# EAGLE design signal (EAGLE 4.16)
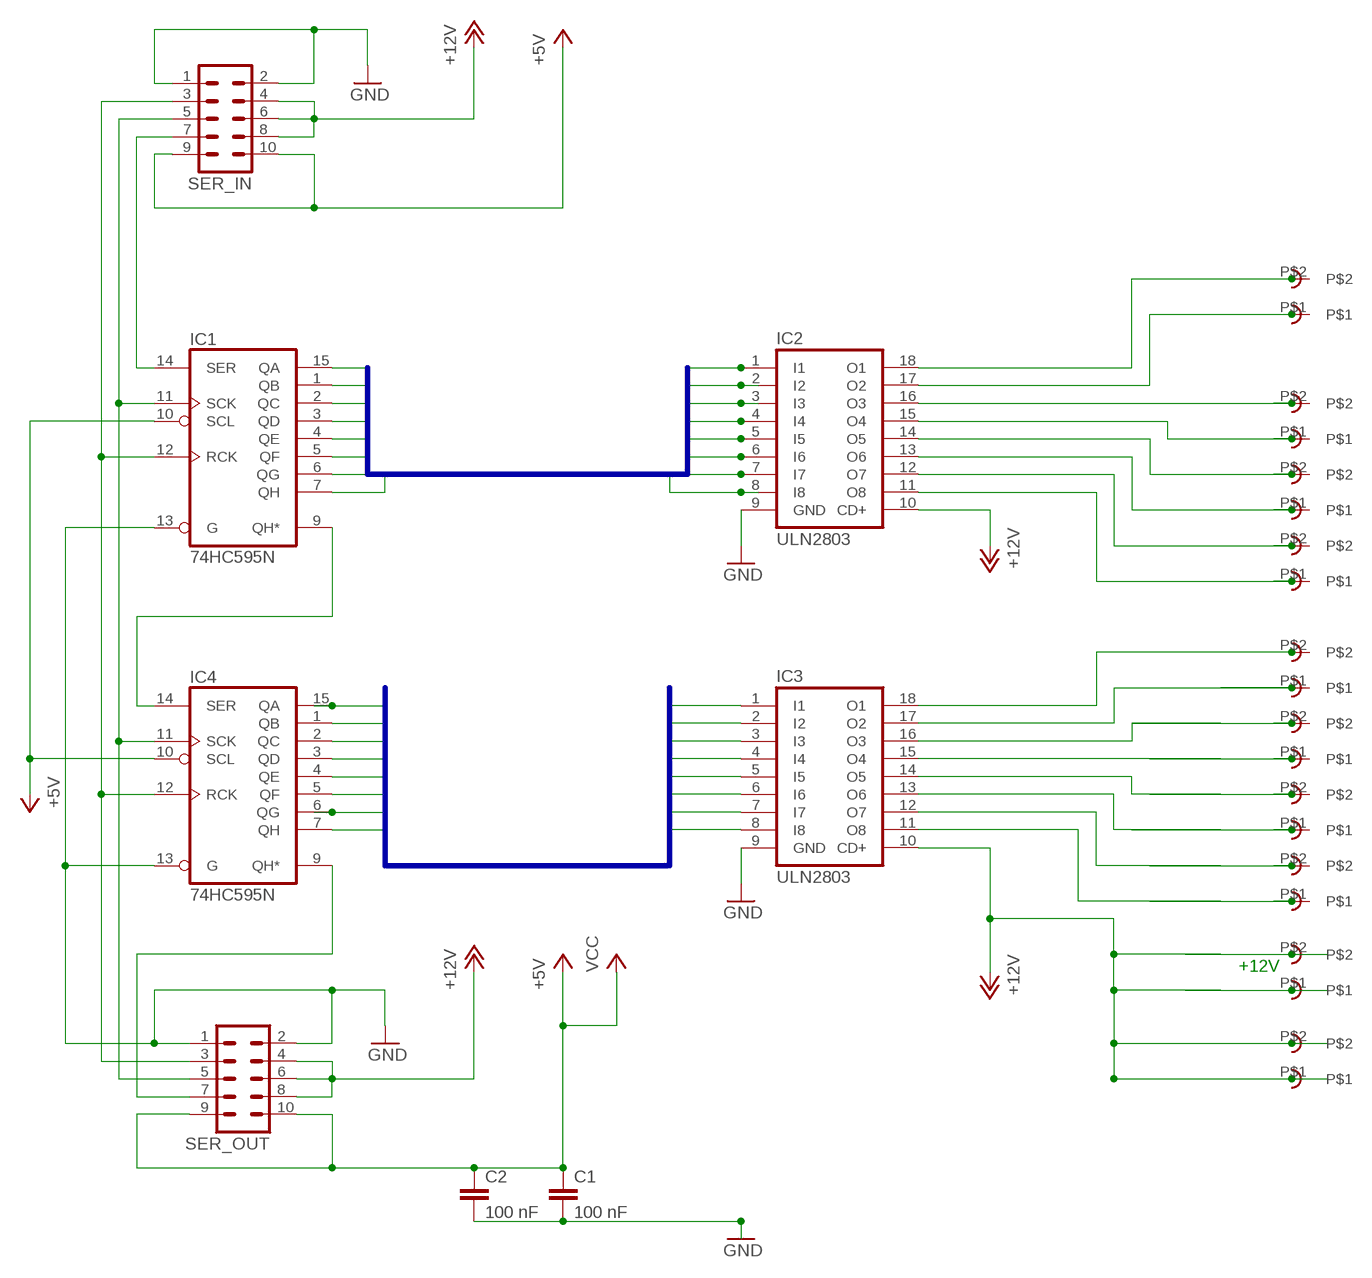
[diagram p0: schematic, sheet 1]

## Parts
C1  100 nF  C-EU025-030X050  [C025-030X050]
C2  100 nF  C-EU025-030X050  [C025-030X050]
IC1  74HC595N  [DIL16]
IC2  ULN2803  ULN2804A  [DIL18]
IC3  ULN2803  ULN2804A  [DIL18]
IC4  74HC595N  [DIL16]
SER_IN  ML10  [ML10]
SER_OUT  ML10  [ML10]
U$11  RIACON101-2  [RIACON101-2]
U$13  RIACON101-2  [RIACON101-2]
U$14  RIACON101-2  [RIACON101-2]
U$15  RIACON101-2  [RIACON101-2]
U$16  RIACON101-2  [RIACON101-2]
U$17  RIACON101-2  [RIACON101-2]
U$18  RIACON101-2  [RIACON101-2]
U$19  RIACON101-2  [RIACON101-2]
U$20  RIACON101-2  [RIACON101-2]
U$21  RIACON101-2  [RIACON101-2]

## Nets
+12V: IC2.10(CD+) IC3.10(CD+) SER_IN.4 SER_IN.6 SER_IN.8 SER_OUT.4 SER_OUT.6 SER_OUT.8 U$20.P$1 U$20.P$2 U$21.P$1 U$21.P$2
BUSA0: IC1.15(QA) IC2.8(I8)
BUSA1: IC1.1(QB) IC2.7(I7)
BUSA2: IC1.2(QC) IC2.6(I6)
BUSA3: IC1.3(QD) IC2.5(I5)
BUSA4: IC1.4(QE) IC2.4(I4)
BUSA5: IC1.5(QF) IC2.3(I3)
BUSA6: IC1.6(QG) IC2.2(I2)
BUSA7: IC1.7(QH) IC2.1(I1)
BUSB0: IC3.8(I8) IC4.15(QA)
BUSB1: IC3.7(I7) IC4.1(QB)
BUSB2: IC3.6(I6) IC4.2(QC)
BUSB3: IC3.5(I5) IC4.3(QD)
BUSB4: IC3.4(I4) IC4.4(QE)
BUSB5: IC3.3(I3) IC4.5(QF)
BUSB6: IC3.2(I2) IC4.6(QG)
BUSB7: IC3.1(I1) IC4.7(QH)
CLOCK: IC1.11(SCK) IC4.11(SCK) SER_IN.5 SER_OUT.5
GND: C1.2 C2.2 IC1.13(G) IC2.9(GND) IC3.9(GND) IC4.13(G) SER_IN.1 SER_IN.2 SER_OUT.1 SER_OUT.2
N$21: IC2.11(O8) U$15.P$1
N$22: IC2.16(O3) U$13.P$2
N$23: IC2.15(O4) U$13.P$1
N$24: IC2.14(O5) U$14.P$2
N$25: IC2.13(O6) U$14.P$1
N$26: IC2.12(O7) U$15.P$2
N$27: IC3.18(O1) U$16.P$2
N$29: IC3.17(O2) U$16.P$1
N$30: IC3.16(O3) U$17.P$2
N$31: IC3.15(O4) U$17.P$1
N$32: IC3.14(O5) U$18.P$2
N$33: IC3.13(O6) U$18.P$1
N$34: IC3.12(O7) U$19.P$2
N$35: IC3.11(O8) U$19.P$1
N$38: IC2.18(O1) U$11.P$2
N$39: IC2.17(O2) U$11.P$1
REG_CLK: IC1.12(RCK) IC4.12(RCK) SER_IN.3 SER_OUT.3
SER_IN: IC1.14(SER) SER_IN.7
SEROUT_NXT_MOD: IC4.9(QH*) SER_OUT.7
SHIFTOUT: IC1.9(QH*) IC4.14(SER)
VCC: C1.1 C2.1 IC1.10(SCL) IC4.10(SCL) SER_IN.9 SER_IN.10 SER_OUT.9 SER_OUT.10 ; supply symbol labelled +5V

## Buses
BUSA[0..7]
BUSB[0..7]

## Notes on the sheet
- +12V

## Power pins joined to a net without a drawn wire
GND: IC1.8(GND) IC4.8(GND)
VCC: IC1.16(VCC) IC4.16(VCC)

## Library data of the parts
C1 C2 = rcl:C-EU: CAPACITOR, European symbol
IC1 IC4 = 74xx-eu:74*595: 8-bit SHIFT REGISTER, output latch
IC2 IC3 = uln-udn:ULN2804A: DRIVER ARRAY
SER_IN SER_OUT = con-harting-ml:ML10: HARTING
U$11 U$13-U$21 = con-riacon101-v2:RIACON101-2: Riaconn Schreaubklemme 101

## Board
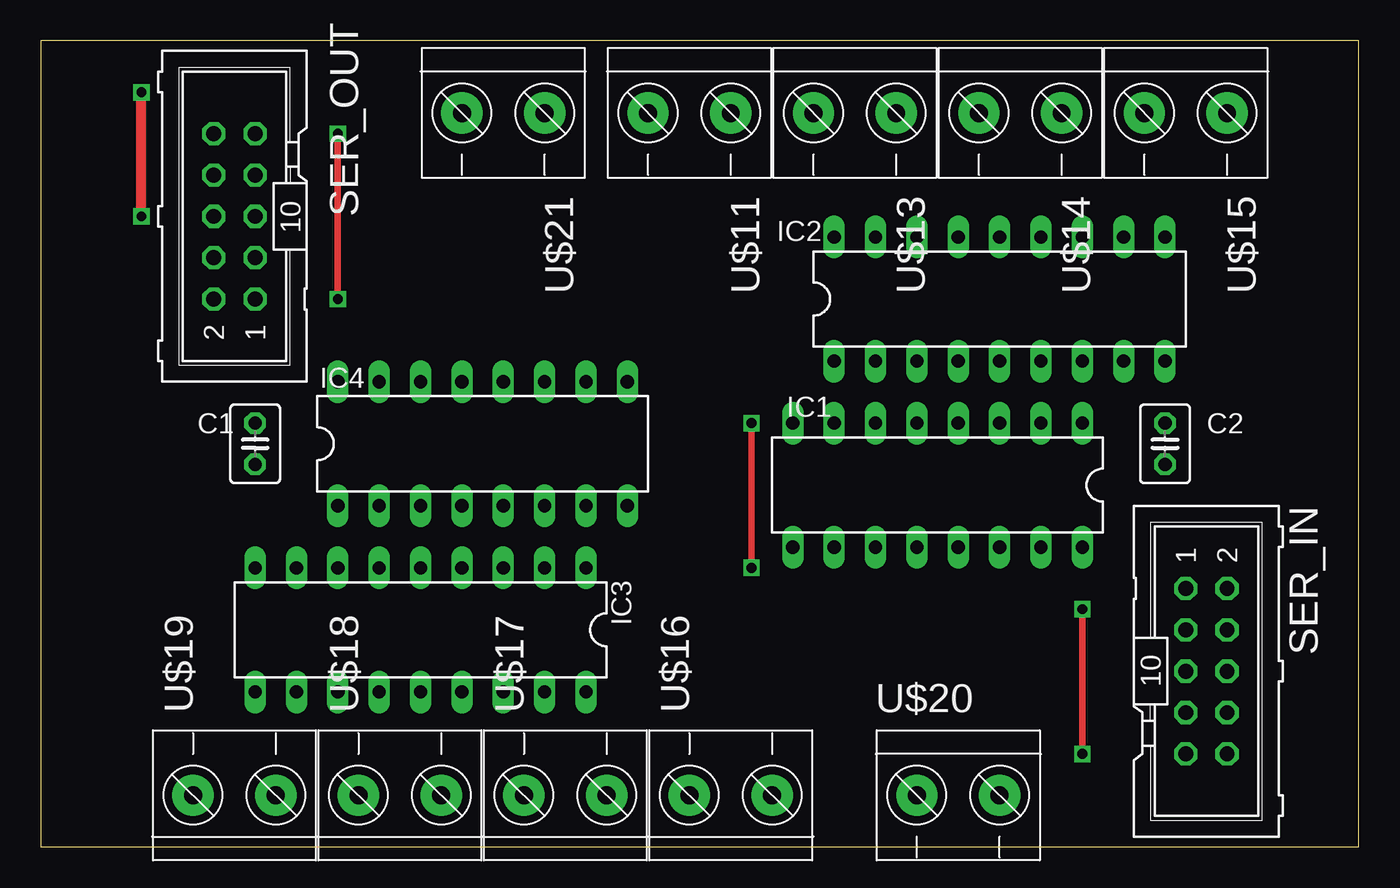
[diagram p1: board, top side]
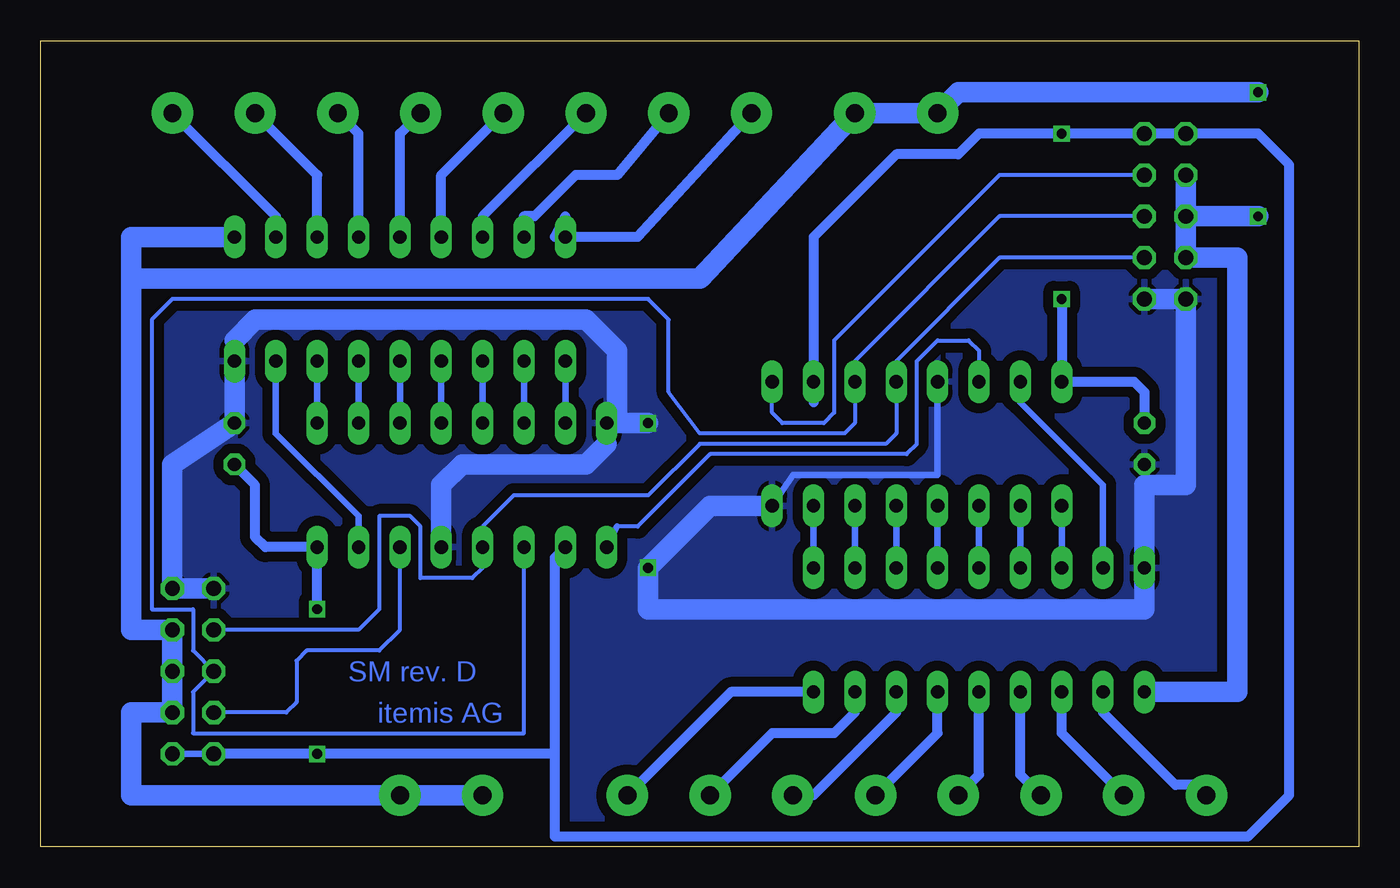
[diagram p2: board, bottom side, seen from below]

Size 80.95 x 49.52 mm. Coordinates in mm from the lower left corner, seen from the top.
Outline: 0,0 80.95,0 80.95,49.52 0,49.52 0,0
Copper layers (1*16): Top 0.035mm / dielectric 1.5mm / Bottom 0.035mm
Design rules "default": minimum track width 10mil, minimum drill 24mil, track to track 8mil, track to pad 8mil, pad to pad 8mil, via to via 8mil, smd to smd 8mil, copper to edge 40mil, drill to drill 8mil, minimum pad ring 10mil, minimum via ring 8mil, stop-mask expansion 4mil, vias tented up to drill 0mil, thermal gap 10mil
tRestrict: area 75.4,0.6 to 80.5,48.9; area 0.5,0.6 to 5.5,48.9
bRestrict: area 51.9,7.6 to 62.1,11.4

### Footprints (pad centres in the part's own frame; a part is rotated, then mirrored left to right if it is on the bottom)
C025-030X050 = drill 0.813 octagon: 1 -1.27,0; 2 1.27,0
DIL16 = drill 0.813 long: 1 -8.89,-3.81; 2 -6.35,-3.81; 3 -3.81,-3.81; 4 -1.27,-3.81; 5 1.27,-3.81; 6 3.81,-3.81; 7 6.35,-3.81; 8 8.89,-3.81; 9 8.89,3.81; 10 6.35,3.81; 11 3.81,3.81; 12 1.27,3.81; 13 -1.27,3.81; 14 -3.81,3.81; 15 -6.35,3.81; 16 -8.89,3.81
DIL18 = drill 0.813 long: 1 -10.16,-3.81; 2 -7.62,-3.81; 3 -5.08,-3.81; 4 -2.54,-3.81; 5 0,-3.81; 6 2.54,-3.81; 7 5.08,-3.81; 8 7.62,-3.81; 9 10.16,-3.81; 10 10.16,3.81; 11 7.62,3.81; 12 5.08,3.81; 13 2.54,3.81; 14 0,3.81; 15 -2.54,3.81; 16 -5.08,3.81; 17 -7.62,3.81; 18 -10.16,3.81
ML10 = drill 0.914 octagon: 1 -5.08,-1.27; 2 -5.08,1.27; 3 -2.54,-1.27; 4 -2.54,1.27; 5 0,-1.27; 6 0,1.27; 7 2.54,-1.27; 8 2.54,1.27; 9 5.08,-1.27; 10 5.08,1.27
RIACON101-2 = drill 1.1 pad 2.54 round: P$1 0,2.54; P$2 0,-2.54

### Placement (x,y rotation side)
C1  13.17,24.76 270 top
C2  69.05,24.76 90 top
IC1  55.08,22.22 180 top
IC2  58.89,33.65 0 top
IC3  23.33,13.33 180 top
IC4  27.14,24.76 0 top
SER_IN  71.59,10.79 270 top
SER_OUT  11.9,38.73 90 top
U$11  39.84,45.08 270 top
U$13  50,45.08 270 top
U$14  60.16,45.08 270 top
U$15  70.32,45.08 270 top
U$16  42.38,3.17 90 top
U$17  32.22,3.17 90 top
U$18  22.06,3.17 90 top
U$19  11.9,3.17 90 top
U$20  56.35,3.17 270 top
U$21  28.41,45.08 270 top

### Tracks (layer width: path | path; a pad name or v marks a point on that pad's centre or on a via)
+12V  (via drill 0.6)
  Top 0.61: v6.18,38.73 v6.18,46.35
  Bottom 0.61: SER_OUT.6 SER_OUT.8
  Bottom 1.27: IC2.10 75.4,37.46 75.4,34.92 | 75.4,34.92 75.4,13.33 SER_IN.4 SER_IN.6 SER_IN.8 75.4,8.25 75.4,3.17 U$20.P$1 U$20.P$2 | IC3.10 7.46,9.52 7.46,36.19 SER_OUT.4 SER_OUT.6 | 75.4,34.92 40.48,34.92 U$21.P$1 U$21.P$2 24.6,46.35 v6.18,46.35 | SER_OUT.6 SER_OUT.8 | SER_OUT.6 v6.18,38.73
BUSA0
  Bottom 0.406: IC2.8 66.51,27.3 66.51,25.39 61.43,20.31 IC1.15
BUSA1
  Bottom 0.406: IC1.1 IC2.7
BUSA2
  Bottom 0.406: IC1.2 IC2.6
BUSA3
  Bottom 0.406: IC1.3 IC2.5
BUSA4
  Bottom 0.406: IC1.4 IC2.4
BUSA5
  Bottom 0.406: IC1.5 IC2.3
BUSA6
  Bottom 0.406: IC1.6 IC2.2
BUSA7
  Bottom 0.406: IC1.7 IC2.1
BUSB0
  Bottom 0.254: 20.79,27.3 IC4.15
  Bottom 0.406: 20.79,27.3 15.71,22.22 IC3.8
BUSB1
  Bottom 0.406: IC3.7 IC4.1
BUSB2
  Bottom 0.406: IC3.6 IC4.2
BUSB3
  Bottom 0.406: IC3.5 IC4.3
BUSB4
  Bottom 0.406: IC3.4 IC4.4
BUSB5
  Bottom 0.406: IC3.3 IC4.5
BUSB6
  Bottom 0.406: IC3.2 IC4.6
BUSB7
  Bottom 0.406: IC3.1 IC4.7
CLOCK
  Bottom 0.254: SER_OUT.5 22.06,38.73 30.95,29.84 IC4.11 30.95,26.03 31.58,25.39 40.48,25.39 42.38,27.93 42.38,32.38 43.65,33.65 72.86,33.65 74.13,32.38 74.13,14.6 71.59,14.6 71.59,12.06 SER_IN.5 71.59,9.52 71.59,6.98 51.27,6.98 IC1.11
GND  (via drill 0.6)
  Top 0.406: v43.65,17.14 v43.65,26.03
  Bottom 0.406: IC4.8 34.76,22.86 25.87,22.86 IC4.13 | SER_IN.2 SER_IN.1 | SER_OUT.2 SER_OUT.1 | 13.17,22.22 C1.2 | 46.19,24.76 IC1.8 45.55,26.66 | 69.05,31.11 IC2.9
  Bottom 1.27: IC4.8 39.84,20.95 v43.65,17.14 43.65,14.6 13.17,14.6 IC3.9 13.17,22.22 10.63,22.22 SER_OUT.2 SER_OUT.1 | v43.65,26.03 IC1.8 | IC1.13 56.35,22.22 55.08,23.49 47.46,23.49 46.19,24.76 | IC2.9 C2.2 72.86,23.49 SER_IN.2 SER_IN.1 | 69.05,31.11 67.78,32.38 47.46,32.38 45.55,30.47 45.55,26.66
  pour Bottom (isolate 0.61): 5.55,48.89 75.4,48.89 75.4,0.63 5.55,0.63
N$21
  Bottom 0.61: IC2.11 66.51,38.73 U$15.P$1
N$22
  Bottom 0.254: 53.81,38.73 IC2.16
  Bottom 0.61: U$13.P$2 53.81,38.73
N$23
  Bottom 0.61: IC2.15 56.35,41.27 U$13.P$1
N$24
  Bottom 0.61: IC2.14 58.89,43.81 U$14.P$2
N$25
  Bottom 0.61: IC2.13 61.43,43.81 U$14.P$1
N$26
  Bottom 0.61: IC2.12 63.97,41.27 U$15.P$2
N$27
  Bottom 0.61: IC3.18 38.57,9.52 U$16.P$2
N$29
  Bottom 0.254: 30.95,8.25 IC3.17
  Bottom 0.61: 30.95,8.25 32.22,6.98 36.03,6.98 U$16.P$1
N$30
  Bottom 0.254: 28.41,8.25 IC3.16
  Bottom 0.61: 28.41,8.25 33.49,3.17 U$17.P$2
N$31
  Bottom 0.61: IC3.15 25.87,6.98 U$17.P$1
N$32
  Bottom 0.61: IC3.14 23.33,4.44 U$18.P$2
N$33
  Bottom 0.61: IC3.13 20.79,4.44 U$18.P$1
N$34
  Bottom 0.254: 18.25,8.25 IC3.12
  Bottom 0.61: 18.25,8.25 18.25,6.98 U$19.P$2
N$35
  Bottom 0.254: 15.71,8.25 IC3.11
  Bottom 0.61: 15.71,8.25 11.27,3.8 10,3.8 U$19.P$1
N$38
  Bottom 0.61: IC2.18 48.73,38.73 49.37,37.46 44.28,37.46 U$11.P$2
N$39
  Bottom 0.61: IC2.17 51.27,38.73 50.63,38.73 48.09,41.27 45.55,41.27 U$11.P$1
REG_CLK
  Bottom 0.254: SER_OUT.3 22.06,36.19 28.41,29.84 IC4.12 28.41,25.39 29.04,24.76 40.48,24.76 43.65,21.58 51.91,21.58 53.81,19.68 IC1.12 53.81,17.14 54.45,16.5 57.62,16.5 57.62,19.68 58.25,20.31 60.16,20.31 60.16,14.6 61.43,13.33 SER_IN.3
SER_IN
  Bottom 0.254: IC1.14 58.89,13.33 60.16,12.06 64.61,12.06 65.24,11.43 65.24,8.89 65.88,8.25 SER_IN.7
SEROUT_NXT_MOD
  Bottom 0.254: IC4.9 36.03,26.66 35.39,26.03 32.85,26.03 32.22,26.66 32.22,31.11 22.06,41.27 SER_OUT.7
SHIFTOUT
  Bottom 0.254: 45.55,19.68 44.28,19.68 39.84,24.12 27.77,24.12 27.14,24.76 27.14,29.84 25.87,31.11 23.96,31.11 23.33,30.47 IC4.14
  Bottom 0.406: 45.55,19.68 IC1.9
VCC  (via drill 0.6)
  Top 0.406: v18.25,43.81 v18.25,33.65 | v63.97,5.71 v63.97,14.6
  Bottom 0.406: SER_IN.9 SER_IN.10
  Bottom 0.61: v18.25,33.65 IC4.16 13.81,28.57 13.17,27.93 C1.1 | 49.37,5.71 v63.97,5.71 SER_IN.9 | v63.97,14.6 IC1.16 67.14,18.41 67.78,19.04 67.78,22.22 C2.1 | 33.49,27.3 IC4.10 33.49,37.46 28.41,42.54 24.6,42.54 23.33,43.81 v18.25,43.81 SER_OUT.9 SER_OUT.10 6.18,43.81 4.28,41.91 4.28,3.17 6.82,0.63 49.37,0.63 49.37,5.71 | 49.37,5.71 49.37,17.77 IC1.10

### Text on the board
Bottom: SM rev. D | itemis AG